# Altium schematic sheet M1_75S2.SchDoc: Sample Sheet Title
size B; Date: MM/DD/YYYY; Author: Sample Author; Organization: ORGANIZATION; Address1: ADDRESS 1; Address2: ADDRESS 2; Address3: ADDRESS 3; Address4: ADDRESS 4; Revision: -; SheetNumber: 2; SheetTotal: 2; ENG_APP_DATE: --/--/--; DSN_APP_DATE: --/--/--; CHK_APP_DATE: --/--/--
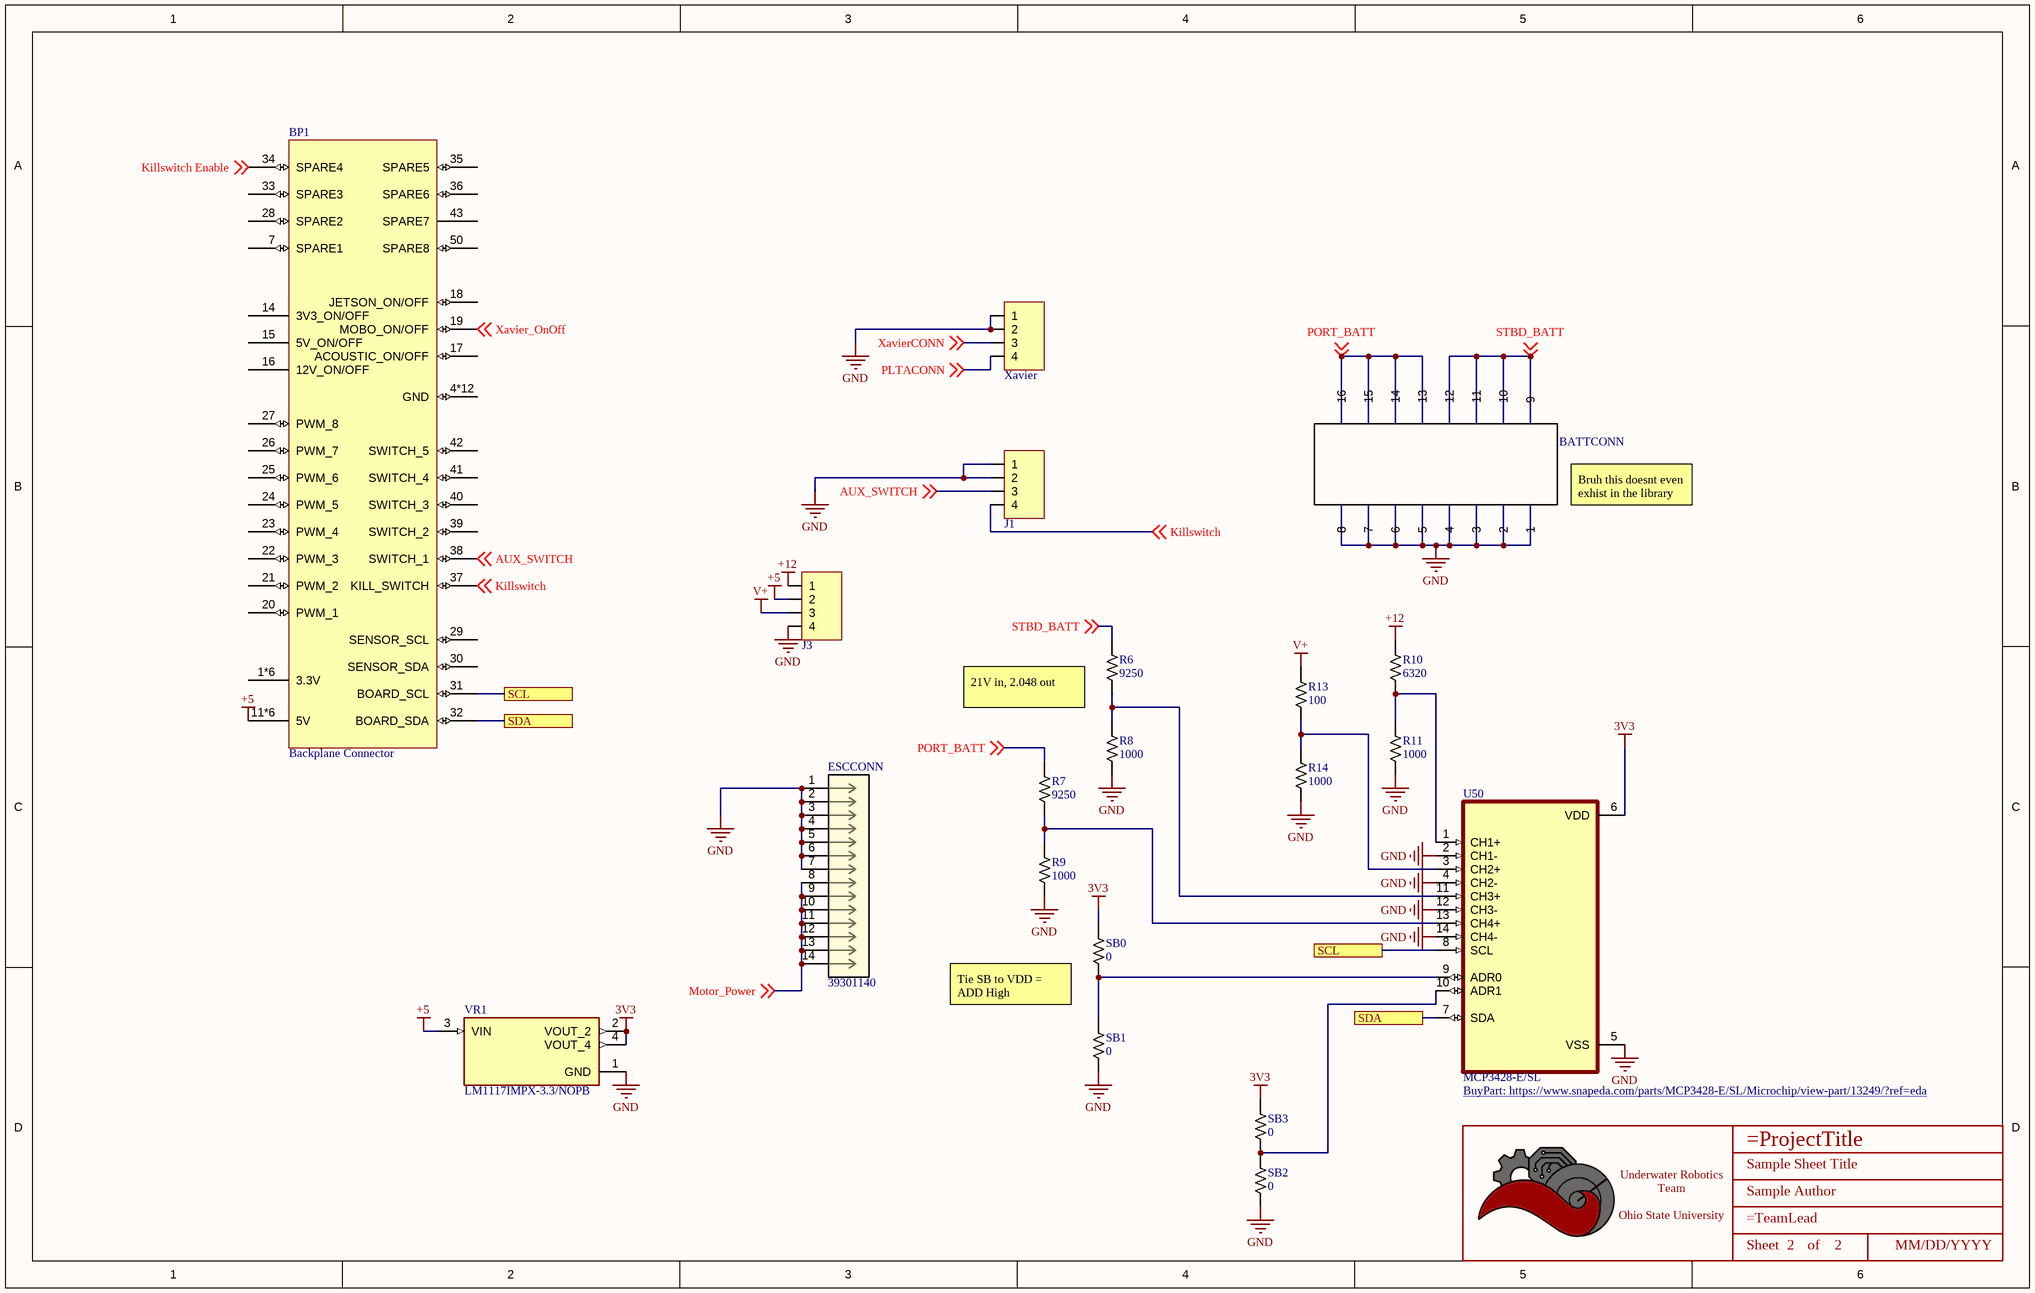
[diagram p0: M1_75S2.SchDoc]

## Parts
*  Title_Block  [LOGO]  (value not drawn)  (graphical)
BATTCONN  BatteryConnector  [CONN_MOLEX_MINIFIT JR_16 POS_R/A - duplicate]  (value not drawn)
BP1  Backplane Connector  [BACKPLANE_EDGE_CONN]
ESCCONN  39301140  [CON_39301140]
J1  4 POS R/A  [CONN_MOLEX_MINIFIT JR_4 POS_R/A]  (value not drawn)
J3  4 POS R/A  [CONN_MOLEX_MINIFIT JR_4 POS_R/A]  (value not drawn)
R6  Value  (Ohms): 9250  [RESISTOR_0603]  (hidden comment: 100 Ohm 5% 1/8W)
R7  Value  (Ohms): 9250  [RESISTOR_0603]  (hidden comment: 100 Ohm 5% 1/8W)
R8  Value  (Ohms): 1000  [RESISTOR_0603]  (hidden comment: 100 Ohm 5% 1/8W)
R9  Value  (Ohms): 1000  [RESISTOR_0603]  (hidden comment: 100 Ohm 5% 1/8W)
R10  Value  (Ohms): 6320  [RESISTOR_0603]  (hidden comment: 100 Ohm 5% 1/8W)
R11  Value  (Ohms): 1000  [RESISTOR_0603]  (hidden comment: 100 Ohm 5% 1/8W)
R13  Value  (Ohms): 100  [RESISTOR_0603]  (hidden comment: 100 Ohm 5% 1/8W)
R14  Value  (Ohms): 1000  [RESISTOR_0603]  (hidden comment: 100 Ohm 5% 1/8W)
SB0  Value  (Ohms): 0  [RESISTOR_0603]  (hidden comment: 0 Ohm Jumper No Fit)
SB1  Value  (Ohms): 0  [RESISTOR_0603]  (hidden comment: 0 Ohm Jumper No Fit)
SB2  Value  (Ohms): 0  [RESISTOR_0603]  (hidden comment: 0 Ohm Jumper No Fit)
SB3  Value  (Ohms): 0  [RESISTOR_0603]  (hidden comment: 0 Ohm Jumper No Fit)
U50  MCP3428-E/SL  [SOIC127P600X175-14N]
VR1  LM1117IMPX-3.3/NOPB  [SOT-223-4]
Xavier  4 POS R/A  [CONN_MOLEX_MINIFIT JR_4 POS_R/A]  (value not drawn)

## Ports
SCL, SDA

## Nets
3V3: SB0.1 SB3.1 U50.6(VDD) VR1.2(VOUT_2) VR1.4(VOUT_4)
+5: BP1.11*6(5V) J3.2 VR1.3(VIN)
+12: J3.1 R10.1
GND: BATTCONN.1 BATTCONN.2 BATTCONN.3 BATTCONN.4 BATTCONN.5 BATTCONN.6 BATTCONN.7 BATTCONN.8 ESCCONN.1 ESCCONN.2 ESCCONN.3 ESCCONN.4 ESCCONN.5 ESCCONN.6 ESCCONN.7 J1.1 J1.2 J3.4 R8.2 R9.2 R11.2 R14.2 SB1.2 SB2.2 U50.2(CH1-) U50.4(CH2-) U50.5(VSS) U50.12(CH3-) U50.14(CH4-) VR1.1(GND) Xavier.1 Xavier.2
V+: J3.3 R13.1
AUX_SWITCH: BP1.38(SWITCH_1) J1.3 ; off-sheet AUX_SWITCH
Killswitch: BP1.37(KILL_SWITCH) J1.4 ; off-sheet Killswitch
Killswitch Enable: BP1.34(SPARE4) ; off-sheet Killswitch Enable
Motor_Power: ESCCONN.8 ESCCONN.9 ESCCONN.10 ESCCONN.11 ESCCONN.12 ESCCONN.13 ESCCONN.14 ; off-sheet Motor_Power
PLTACONN: Xavier.4 ; off-sheet PLTACONN
PORT_BATT: BATTCONN.13 BATTCONN.14 BATTCONN.15 BATTCONN.16 R7.1 ; off-sheet PORT_BATT
SCL: BP1.31(BOARD_SCL) U50.8(SCL) ; port SCL
SDA: BP1.32(BOARD_SDA) U50.7(SDA) ; port SDA
STBD_BATT: BATTCONN.9 BATTCONN.10 BATTCONN.11 BATTCONN.12 R6.1 ; off-sheet STBD_BATT
Xavier_OnOff: BP1.19(MOBO_ON/OFF) ; off-sheet Xavier_OnOff
XavierCONN: Xavier.3 ; off-sheet XavierCONN
NetR6_2: R6.2 R8.1 U50.11(CH3+)
NetR7_2: R7.2 R9.1 U50.13(CH4+)
NetR10_2: R10.2 R11.1 U50.1(CH1+)
NetR13_2: R13.2 R14.1 U50.3(CH2+)
NetSB0_2: SB0.2 SB1.1 U50.9(ADR0)
NetSB2_1: SB2.1 SB3.2 U50.10(ADR1)

Not connected (* = marked no-connect by the designer): BP1 1*6(3.3V) 4*12(GND) 7(SPARE1) 14(3V3_ON/OFF) 15(5V_ON/OFF) 16(12V_ON/OFF) 17(ACOUSTIC_ON/OFF) 18(JETSON_ON/OFF) 20(PWM_1) 21(PWM_2) 22(PWM_3) 23(PWM_4) 24(PWM_5) 25(PWM_6) 26(PWM_7) 27(PWM_8) 28(SPARE2) 29(SENSOR_SCL) 30(SENSOR_SDA) 33(SPARE3) 35(SPARE5) 36(SPARE6) 39(SWITCH_2) 40(SWITCH_3) 41(SWITCH_4) 42(SWITCH_5) 43(SPARE7) 50(SPARE8)

## Notes on the sheet
- (near BATTCONN) Bruh this doesnt even exhist in the library
- 21V in, 2.048 out
- Tie SB to VDD = ADD High
- DWG. NO.
- REV.
- SHT.
- THIS DOCUMENT AND THE DATA DISCLOSED HEREIN OR HEREWITH IS THE PROPERTY OF ALTIUM LIMITED AND MAY BE FREELY DISTRIBUTED IN WHOLE. NO RIGHTS ARE RESERVED OR EXPRESS OR IMPLIED WARANTEE GIVEN.
- REVISION
- DESCRIPTION
- DATE
- APPROVED
- ENG:
- APPROVALS
- PROJECT
- DSN:
- CHK:
- REFERENCE DOCUMENTS
- PROJECT REVISION:
- TITLE
- DOCUMENT REVISION:
- DESIGN ITEM:
- BOM:
- FAB DWG:
- PCB DWG:
- ASSY DWG:
- SCALE:
- SIZE
- B
- CAGE CODE
- FILE NAME
- DWG NO.
- SHEET
- OF
- REV
- (in symbol Title_Block) Underwater Robotics Team / Ohio State University; Sheet; of

## Library data of the parts
* = Title_Block: UWRT Schematic Title Block Template / Created June 2021, Dylan Trainor
BP1 = BACKPLANE_EDGE_CONN: Titan Backplane Edge Connector; pin to pad: 1*6>1+2+3+54+55+56 4*12>4+5+6+8+9+10+47+48+49+51+52+53 11*6>11+12+13+44+45+46
ESCCONN = 39301140: No Description Available; Mfr_Name: Molex Connector Corporation; Copyright: Copyright (C) 2022 Ultra Librarian. All rights reserved.; Manufacturer_Part_Number: 39301140; RefDes: RefDes; Type: DEV
J1 J3 Xavier = CONN_MOLEX_MINIFIT JR_4POS_R/A: Molex Minifit Jr. 5569 / 4 Pos R/A Natural; Pitch: 4.2mm; Configuration: Right Angle; Current Per Pin: 13A; Number of Positions: 4; Supplier Part Number 1: WM13112-ND; Supplier 1: Digi-Key; Manufacturer: Molex; Color: Natural; Created By: Flip B; ComponentLink1Description: Datasheet; ComponentLink1URL: https://www.molex.com/pdm_docs/sd/026013115_sd.pdf; Series: Minifit Jr 5569
R6-R11 R13 R14 = RESISTOR_100_0603: RES 100 OHM 5% 1/8W 0603; Tolerance: +/- 5%; Made By: Flip B; ComponentLink1Description: Digikey; ComponentLink1URL: https://www.digikey.com/en/products/detail/koa-speer-electronics-inc/RK73B1JTTD101J/9844701; Supplier 1: Digi-Key; Supplier Part Number 1: 2019-RK73B1JTTD101JCT-ND; Wattage: 1/8W
SB0-SB3 = JUMPER_0_0603: 0 Ohm Jumper No Fit for Solder Bridge; Made By: Robert Pafford; ComponentLink1Description: Digikey; ComponentLink1URL: https://www.digikey.com/en/products/detail/koa-speer-electronics-inc/RK73B1JTTD101J/9844701
U50 = MCP3428-E/SL: 16 Bit Analog to Digital Converter 4 Input 1 Sigma-Delta 14-SOIC; MF: Microchip; Package: SOIC-14 Microchip; SnapEDA_Link: https://www.snapeda.com/parts/MCP3428-E/SL/Microchip/view-part/13249/?ref=snap; MP: MCP3428-E/SL; Price: None; Availability: Unavailable; Value: *; BuyPart: https://www.snapeda.com/parts/MCP3428-E/SL/Microchip/view-part/13249/?ref=eda
VR1 = LM1117IMPX-3.3/NOPB: 800-mA 15-V linear voltage regulator 4-SOT-223 -40 to 125; MF: Texas Instruments; Texas_Instruments-Purchase-URL: https://snapeda.com/shop?store=Texas+Instruments&id=410186; Price: None; Mouser-Purchase-URL: https://snapeda.com/shop?store=Mouser&id=410186; MP: LM1117IMPX-3.3/NOPB; Value: *; Availability: Good; Package: SOT-223-4 Texas Instruments; Arrow_Electronics-Purchase-URL: https://snapeda.com/shop?store=Arrow+Electronics&id=410186; SnapEDA_Link: https://www.snapeda.com/parts/LM1117IMPX-3.3/NOPB/Texas%20Instruments/view-part/410186/?ref=snap; DigiKey-Purchase-URL: https://snapeda.com/shop?store=DigiKey&id=410186